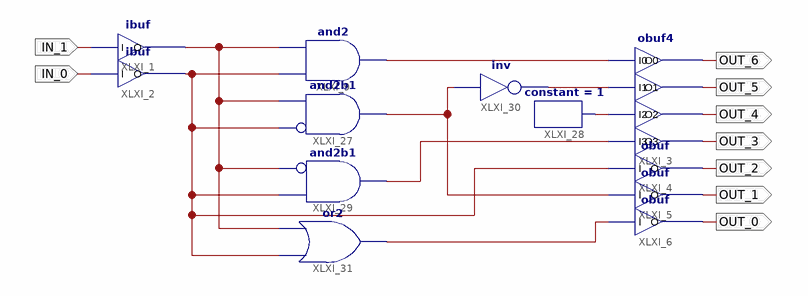
[diagram p0: schematic sheet 1]
// Xilinx ISE schematic Decoder2To7.sch (spartan3a) as structural Verilog: 12 symbols, 9 ports
module Decoder2To7 (
  input  IN_0,
  input  IN_1,
  output OUT_6,
  output OUT_5,
  output OUT_4,
  output OUT_3,
  output OUT_2,
  output OUT_1,
  output OUT_0
);

  wire XLXN_12, XLXN_37, XLXN_38, XLXN_39, XLXN_40, XLXN_44, XLXN_47, XLXN_48;

  obuf4 XLXI_3 (.I0(XLXN_12), .I1(XLXN_48), .I2(XLXN_39), .I3(XLXN_40), .O0(OUT_6), .O1(OUT_5), .O2(OUT_4), .O3(OUT_3));
  obuf XLXI_4 (.I(XLXN_38), .O(OUT_2));
  obuf XLXI_5 (.I(XLXN_47), .O(OUT_1));
  obuf XLXI_6 (.I(XLXN_44), .O(OUT_0));
  and XLXI_9 (XLXN_12, XLXN_38, XLXN_37);
  ibuf XLXI_2 (.I(IN_0), .O(XLXN_38));
  ibuf XLXI_1 (.I(IN_1), .O(XLXN_37));
  and XLXI_27 (XLXN_47, ~XLXN_38, XLXN_37);  // and2b1
  constant #(.CValue("1")) XLXI_28 (.O(XLXN_39));
  and XLXI_29 (XLXN_40, ~XLXN_37, XLXN_38);  // and2b1
  or XLXI_31 (XLXN_44, XLXN_38, XLXN_37);
  not XLXI_30 (XLXN_48, XLXN_47);
endmodule
